# Altium schematic sheet structure.SchDoc
size 594 x 420 mm; Нач. отд.: Нач. отд.; Фамилия нач. отд.: Сидоров; Address1: Address1; Address2: Address2; Address3: Address3; Address4: Address4; SheetNumber: 1; Scale: 1:1; Обозначение документа: АБВГ.123456.001Э3; Наименование организации: ОАО "Ваша фирма"; Перв. применение: АБВГ.123456.000; Наименование изделия 1: Плата; Наименование изделия 2: Схема электрическая; Наименование изделия 3: принципиальная
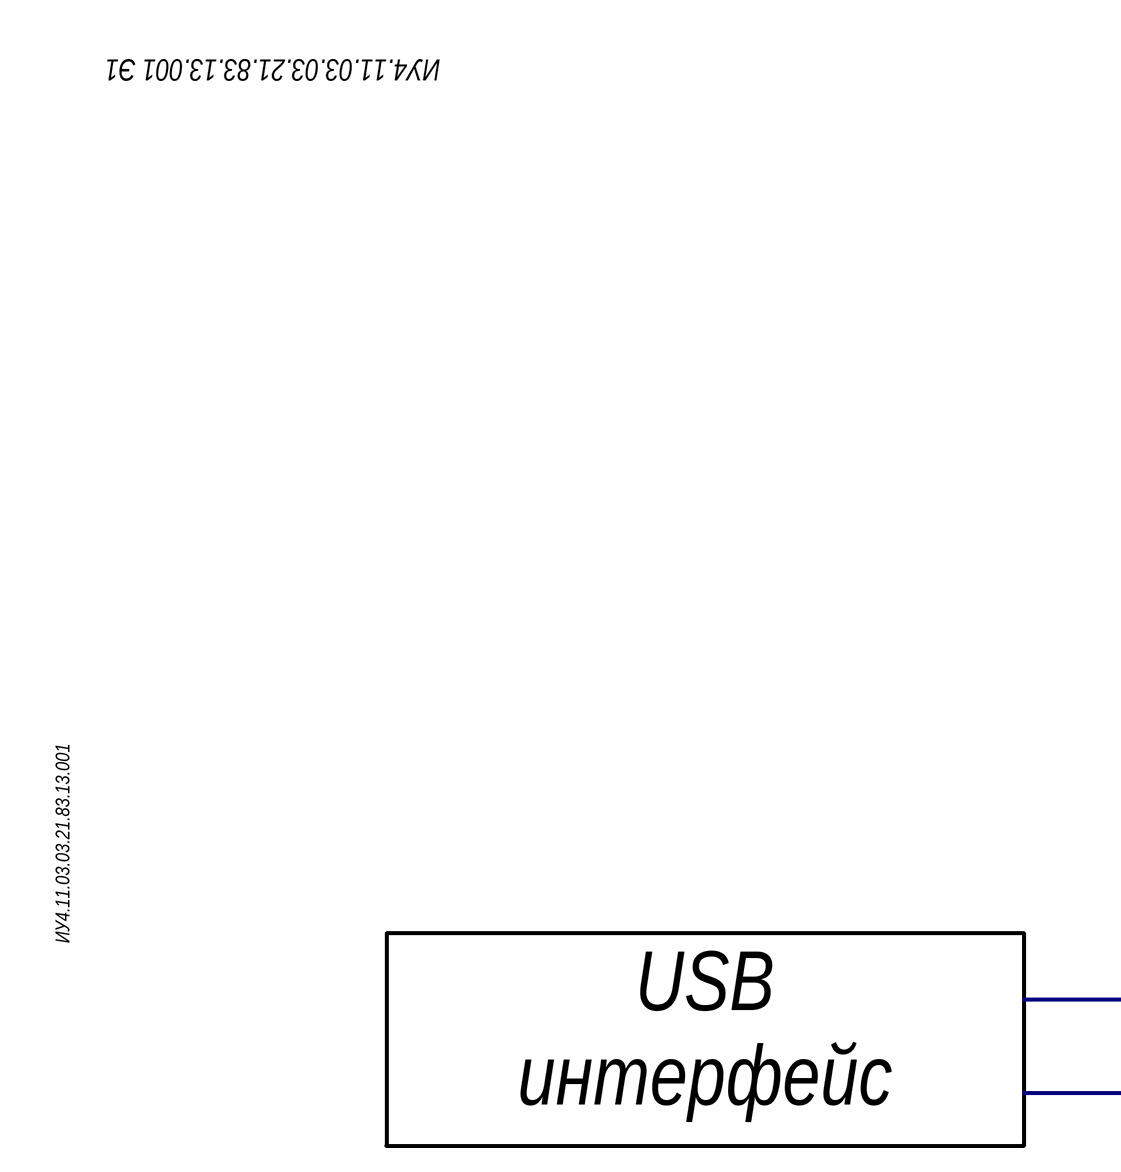
[diagram p0: structure.SchDoc, top left]
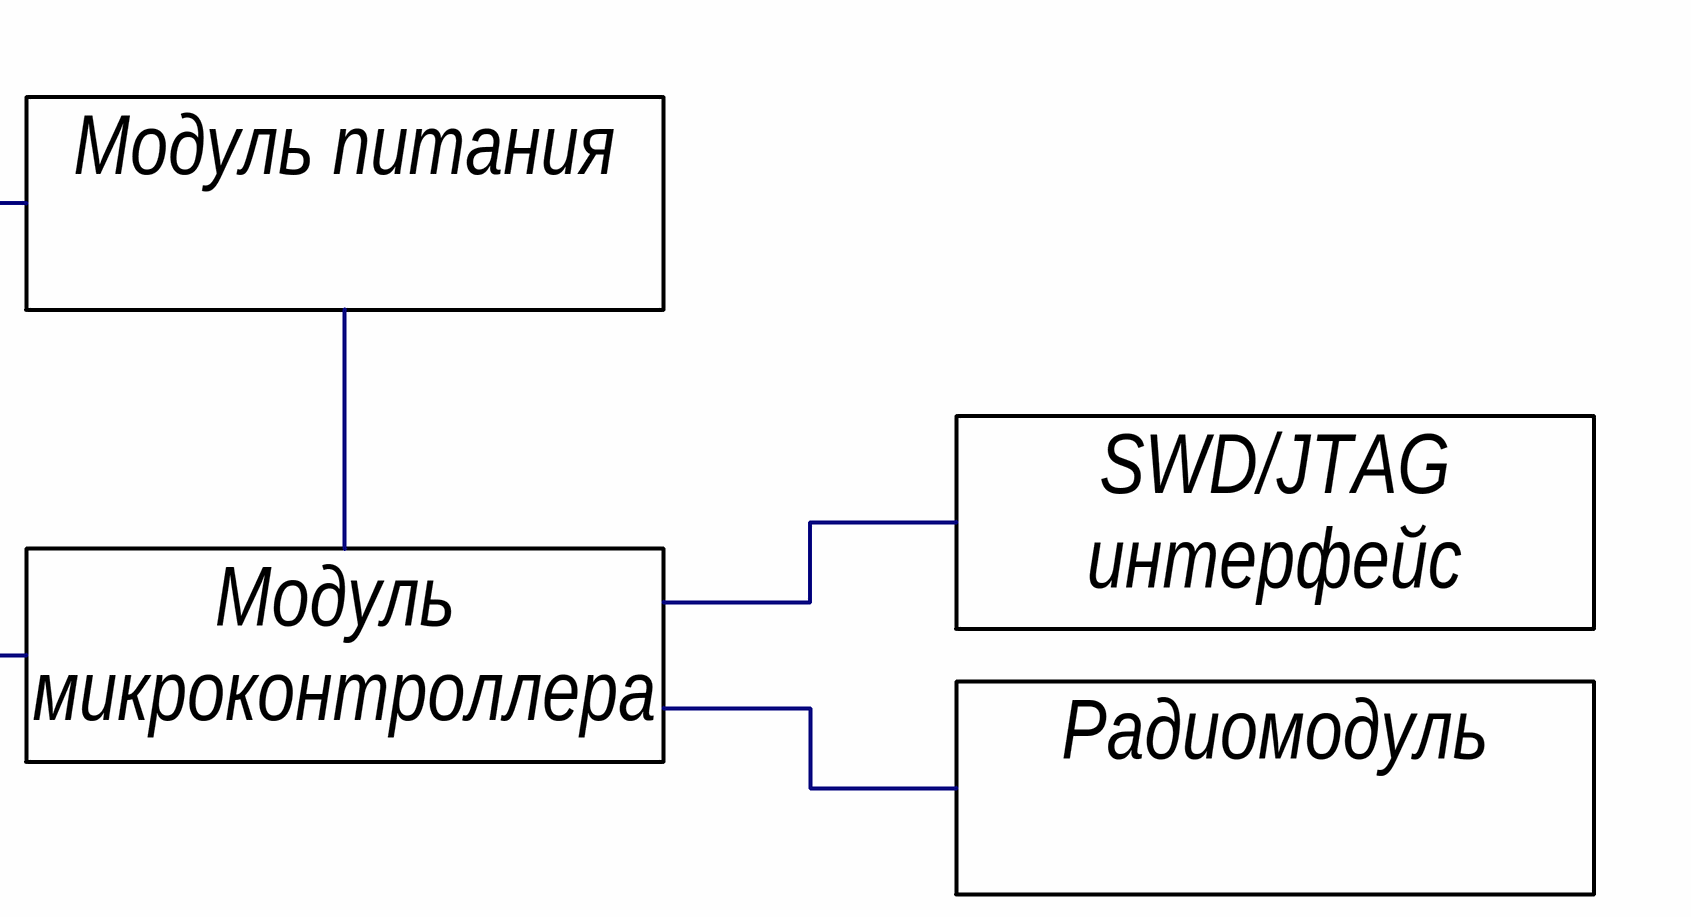
[diagram p1: structure.SchDoc, top right]
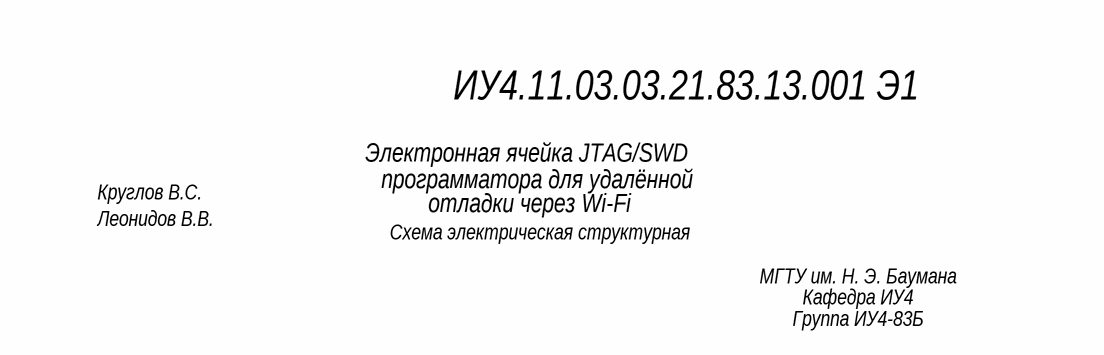
[diagram p2: structure.SchDoc, bottom right]

## Notes on the sheet
- ИУ4.11.03.03.21.83.13.001 Э1
- Модуль питания
- ИУ4.11.03.03.21.83.13.001
- SWD/JTAG
  интерфейс
- USB
  интерфейс
- Модуль
  микроконтроллера
- Радиомодуль
- Электронная ячейка JTAG/SWD
- программатора для удалённой
- Круглов В.С.
- Леонидов В.В.
- Схема электрическая структурная
- отладки через Wi-Fi
- МГТУ им. Н. Э. Баумана
- Кафедра ИУ4
- Группа ИУ4-83Б
- Перв. примен.
- Справ. №
- Подп. и дата
- Инв. № дубл.
- Взам. инв. №
- Разраб.
- Изм.
- Лист
- № докум.
- Подп.
- Дата
- Лит.
- Масса
- Масштаб
- Пров.
- Т. контр.
- Листов
- 1
- Инв. № подл.
- Н. контр.
- Утв.
- Копировал
- Формат А2